# EAGLE board untitled (EAGLE 8.1.0)
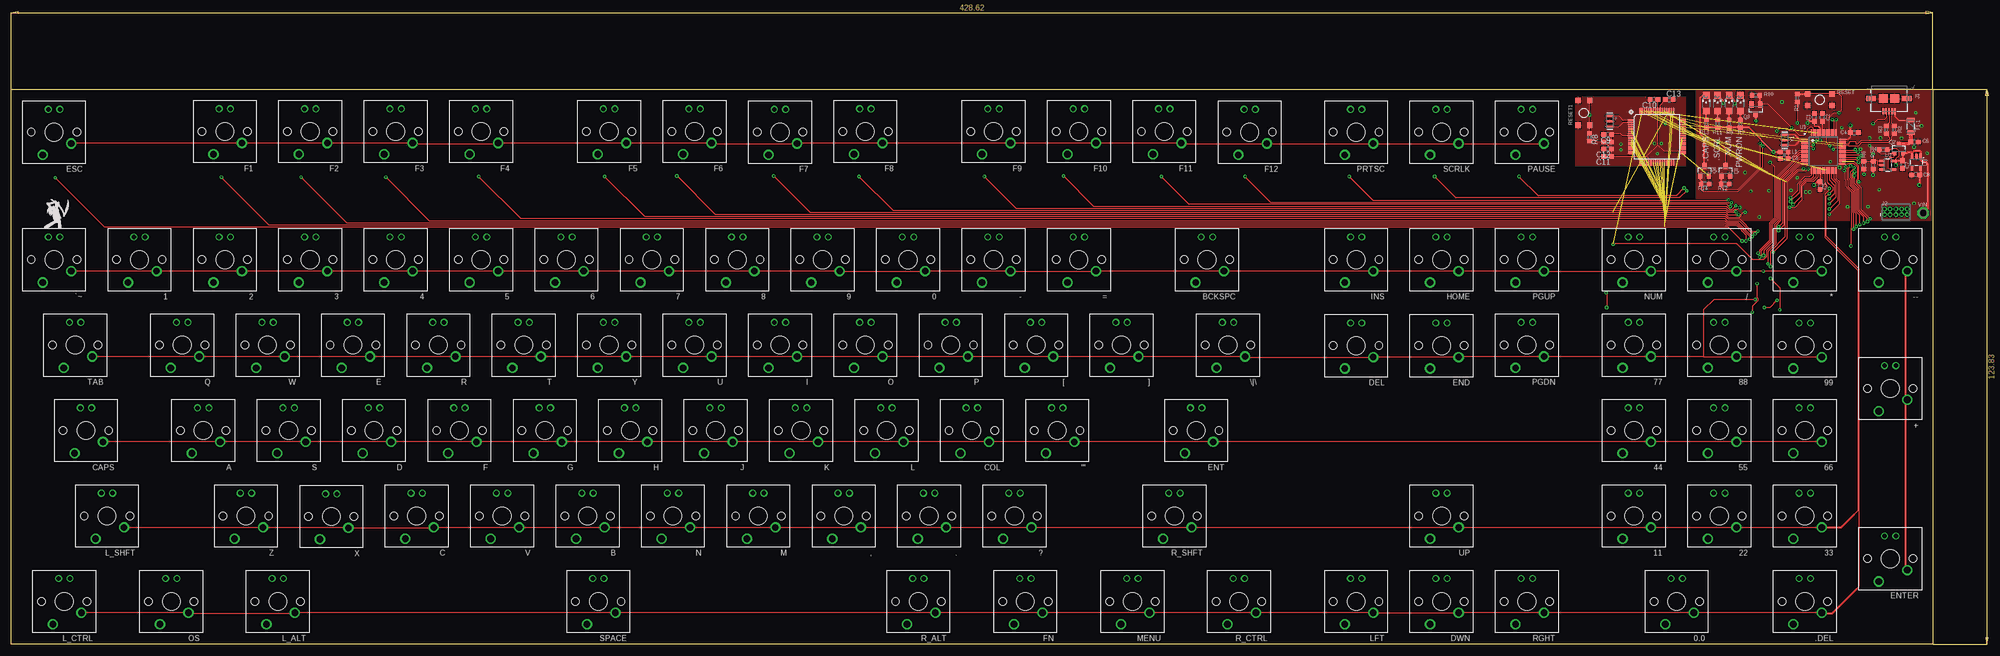
[diagram p6: board, top side]
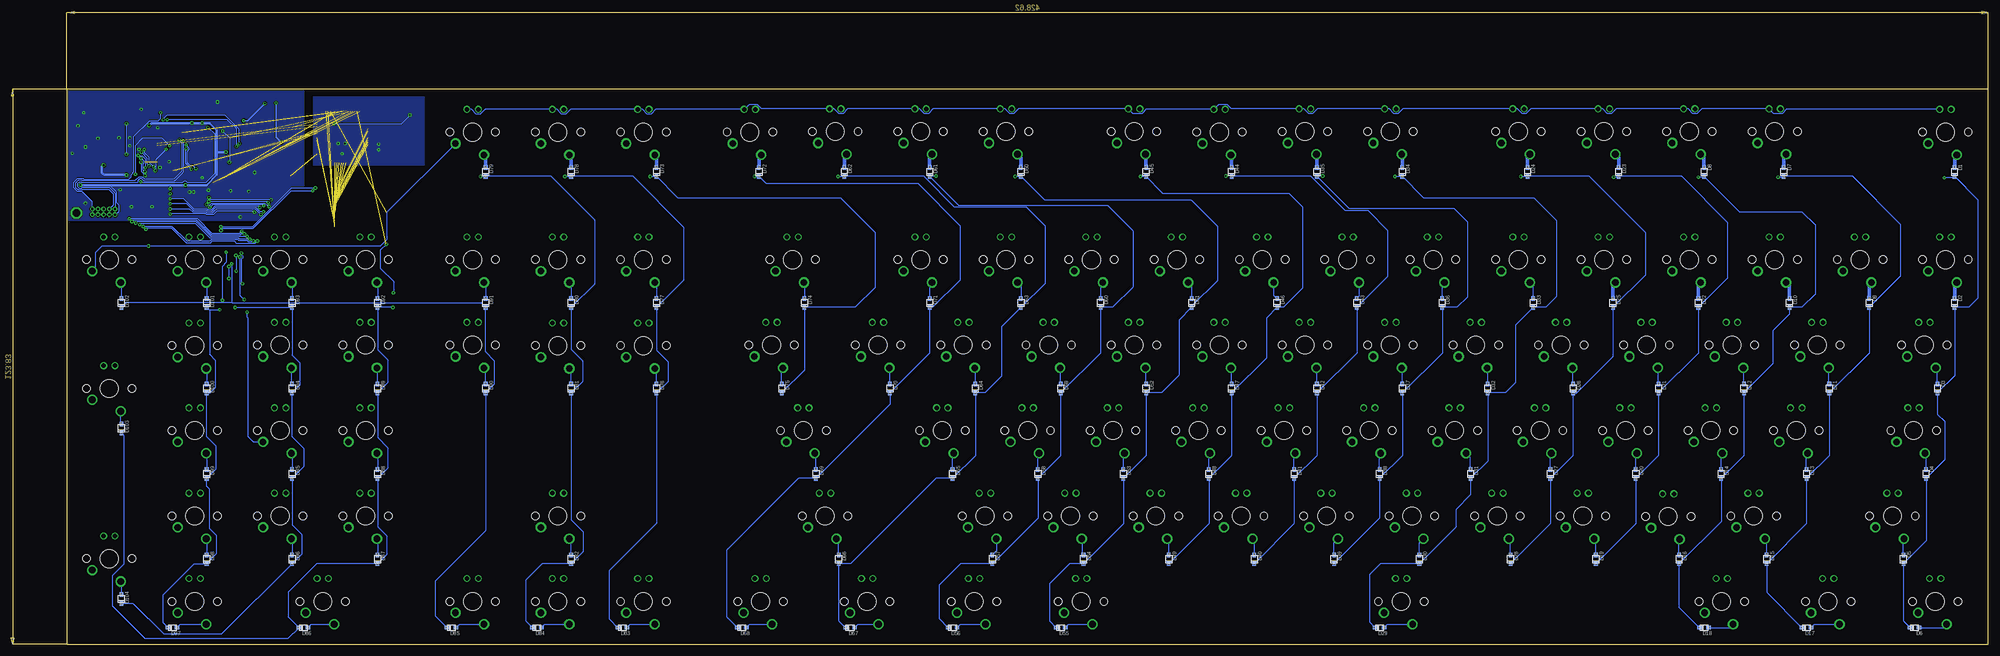
[diagram p7: board, bottom side, seen from below]

Size 428.62 x 123.83 mm. Coordinates in mm from the lower left corner, seen from the top.
Outline: 0,123.83 428.62,123.83 428.62,0 0,0 0,123.83
Copper layers (1*16): Top 0.035mm / dielectric 1.5mm / Bottom 0.035mm
Design rules "default *": minimum track width 8mil, minimum drill 0.3mm, track to track 6mil, track to pad 6mil, pad to pad 6mil, via to via 6mil, smd to smd 6mil, copper to edge 10mil, drill to drill 8mil, minimum pad ring 10mil, minimum via ring 8mil, stop-mask expansion 4mil, vias tented up to drill 15mil, thermal gap 10mil
Net classes: 1 USB: width 0.254 mm, drill 0.33 mm, clearance 0.159 mm; 2 Top GND Pour: clearance 0.762 mm to class 1

## Footprints (pad centres in the part's own frame; a part is rotated, then mirrored left to right if it is on the bottom)
CHERRY_MX = drill 1.5: 1 -3.81,2.54; 2 2.54,5.08 | drill 1: A -1.27,-5.08; K 1.27,-5.08 | hole 4: 0,0 | hole 1.7: 5.08,0; -5.08,0
CHIPLED_1206 = smd 1.5 x 1.5: A 0,-1.75; C 0,1.75
C0603 = smd 1.1 x 1: 1 -0.85,0; 2 0.85,0
SOD-323F = smd 1 x 0.8: A -1,0; C 1,0
PTC-1206 = smd 1 x 1.8: 1 -1.4,0; 2 1.4,0
USB_AB_MICRO_1:1_V2 = smd 1.4 x 0.4: D+ 2.85,0; D- 2.85,0.65; GND 2.85,-1.3; ID 2.85,-0.65; VBUS 2.85,1.3 | smd 1.27 x 2.2: SHIELD1 0,4; SHIELD4 0,-4 | smd 1.9 x 2: SHIELD2 0,1.25; SHIELD3 0,-1.25
2X5-PTH-1.27MM = drill 0.508 pad 1: 1 -2.54,-0.635; 2 -2.54,0.635; 3 -1.27,-0.635; 4 -1.27,0.635; 5 0,-0.635; 6 0,0.635; 7 1.27,-0.635; 8 1.27,0.635; 9 2.54,-0.635; 10 2.54,0.635
0603 = smd 1.1 x 1: 1 -0.85,0; 2 0.85,0
SOT23 = smd 1 x 1.4: 1 -0.95,-1.1; 2 0.95,-1.1; 3 0,1.1
SOT23-3 = smd 0.8 x 0.9: 1 -0.95,-1; 2 0.95,-1; 3 0,1.1
R0603 = smd 1 x 1.1: 1 -0.85,0; 2 0.85,0
7914G = smd 1.27 x 1.27: 1 0,0; 2 0,5.486; 3 2.54,0; 4 2.54,5.486
QFP50P900X900X120-48N = smd 1.45 x 0.3: 1 -4.2,2.75; 2 -4.2,2.25; 3 -4.2,1.75; 4 -4.2,1.25; 5 -4.2,0.75; 6 -4.2,0.25; 7 -4.2,-0.25; 8 -4.2,-0.75; 9 -4.2,-1.25; 10 -4.2,-1.75; 11 -4.2,-2.25; 12 -4.2,-2.75; 25 4.17,-2.75; 26 4.2,-2.25; 27 4.2,-1.75; 28 4.2,-1.25; 29 4.2,-0.75; 30 4.2,-0.25; 31 4.2,0.25; 32 4.2,0.75; 33 4.2,1.25; 34 4.2,1.75; 35 4.2,2.25; 36 4.2,2.75 | smd 0.3 x 1.45: 13 -2.75,-4.2; 14 -2.25,-4.2; 15 -1.75,-4.2; 16 -1.25,-4.2; 17 -0.75,-4.2; 18 -0.25,-4.2; 19 0.25,-4.2; 20 0.75,-4.2; 21 1.25,-4.2; 22 1.75,-4.2; 23 2.25,-4.2; 24 2.75,-4.2; 37 2.75,4.2; 38 2.25,4.2; 39 1.75,4.2; 40 1.25,4.2; 41 0.75,4.2; 42 0.25,4.2; 43 -0.25,4.2; 44 -0.75,4.2; 45 -1.25,4.2; 46 -1.75,4.2; 47 -2.25,4.2; 48 -2.75,4.2
SOT23-5 = smd 0.55 x 1.2: 1 -0.95,-1.3; 2 0,-1.3; 3 0.95,-1.3; 4 0.95,1.3; 5 -0.95,1.3
ATSAMD21J18 = smd 1.5 x 0.3: 1 -5.7,3.75; 2 -5.7,3.25; 3 -5.7,2.75; 4 -5.7,2.25; 5 -5.7,1.75; 6 -5.7,1.25; 7 -5.7,0.75; 8 -5.7,0.25; 9 -5.7,-0.25; 10 -5.7,-0.75; 11 -5.7,-1.25; 12 -5.7,-1.75; 13 -5.7,-2.25; 14 -5.7,-2.75; 15 -5.7,-3.25; 16 -5.7,-3.75; 33 5.75,-3.75; 34 5.75,-3.25; 35 5.75,-2.75; 36 5.75,-2.25; 37 5.75,-1.75; 38 5.75,-1.25; 39 5.75,-0.75; 40 5.75,-0.25; 41 5.75,0.25; 42 5.75,0.75; 43 5.75,1.25; 44 5.75,1.75; 45 5.75,2.25; 46 5.75,2.75; 47 5.75,3.25; 48 5.75,3.75 | smd 0.3 x 1.5: 17 -3.75,-5.75; 18 -3.25,-5.75; 19 -2.75,-5.75; 20 -2.25,-5.75; 21 -1.75,-5.75; 22 -1.25,-5.75; 23 -0.75,-5.75; 24 -0.25,-5.75; 25 0.25,-5.75; 26 0.75,-5.75; 27 1.25,-5.75; 28 1.75,-5.75; 29 2.25,-5.75; 30 2.75,-5.75; 31 3.25,-5.75; 32 3.75,-5.75; 49 3.75,5.75; 50 3.25,5.75; 51 2.75,5.75; 52 2.25,5.75; 53 1.75,5.75; 54 1.25,5.75; 55 0.75,5.75; 56 0.25,5.75; 57 -0.25,5.75; 58 -0.75,5.75; 59 -1.25,5.75; 60 -1.75,5.75; 61 -2.25,5.75; 62 -2.75,5.75; 63 -3.25,5.75; 64 -3.75,5.75
P1-17 = drill 1.702 pad 2.54 octagon: TP 0,0
RESONATOR-SMD = smd 0.45 x 1.905: 1 -1.2,0; 2 0,0; 3 1.2,0

## Placement (x,y rotation side)
0  CHERRY_MX  [CHERRY_MX]  200.06,85.77 180 top
0.0  CHERRY_MX  [CHERRY_MX]  371.51,9.57 180 top
1  CHERRY_MX  [CHERRY_MX]  28.61,85.77 180 top
2  CHERRY_MX  [CHERRY_MX]  47.66,85.77 180 top
3  CHERRY_MX  [CHERRY_MX]  66.71,85.77 180 top
4  CHERRY_MX  [CHERRY_MX]  85.76,85.77 180 top
5  CHERRY_MX  [CHERRY_MX]  104.81,85.77 180 top
6  CHERRY_MX  [CHERRY_MX]  123.86,85.77 180 top
7  CHERRY_MX  [CHERRY_MX]  142.91,85.77 180 top
8  CHERRY_MX  [CHERRY_MX]  161.96,85.77 180 top
9  CHERRY_MX  [CHERRY_MX]  181.01,85.77 180 top
11  CHERRY_MX  [CHERRY_MX]  361.98,28.62 180 top
22  CHERRY_MX  [CHERRY_MX]  381.03,28.62 180 top
33  CHERRY_MX  [CHERRY_MX]  400.08,28.62 180 top
44  CHERRY_MX  [CHERRY_MX]  361.98,47.67 180 top
55  CHERRY_MX  [CHERRY_MX]  381.03,47.67 180 top
66  CHERRY_MX  [CHERRY_MX]  400.08,47.67 180 top
77  CHERRY_MX  [CHERRY_MX]  361.98,66.72 180 top
88  CHERRY_MX  [CHERRY_MX]  381.03,66.72 180 top
99  CHERRY_MX  [CHERRY_MX]  400.08,66.59 180 top
'"  CHERRY_MX  [CHERRY_MX]  233.33,47.67 180 top
*  CHERRY_MX  [CHERRY_MX]  400.08,85.77 180 top
+  CHERRY_MX  [CHERRY_MX]  419.13,57.07 180 top
,  CHERRY_MX  [CHERRY_MX]  185.71,28.62 180 top
-  CHERRY_MX  [CHERRY_MX]  219.11,85.77 180 top
--  CHERRY_MX  [CHERRY_MX]  419.13,85.77 180 top
.  CHERRY_MX  [CHERRY_MX]  204.76,28.62 180 top
.CAPS  [CHIPLED_1206]  378.11,120.7 0 top
.DEL  CHERRY_MX  [CHERRY_MX]  400.08,9.57 180 top
.NUM  [CHIPLED_1206]  383.19,120.7 0 top
.SCRL  [CHIPLED_1206]  380.65,120.7 0 top
/  CHERRY_MX  [CHERRY_MX]  381.03,85.77 180 top
=  CHERRY_MX  [CHERRY_MX]  238.16,85.77 180 top
?  CHERRY_MX  [CHERRY_MX]  223.81,28.62 180 top
[  CHERRY_MX  [CHERRY_MX]  228.63,66.72 180 top
\|\  CHERRY_MX  [CHERRY_MX]  271.43,66.72 180 top
]  CHERRY_MX  [CHERRY_MX]  247.68,66.72 180 top
`~  CHERRY_MX  [CHERRY_MX]  9.56,85.77 180 top
A  CHERRY_MX  [CHERRY_MX]  42.83,47.67 180 top
B  CHERRY_MX  [CHERRY_MX]  128.56,28.62 180 top
BCKSPC  CHERRY_MX  [CHERRY_MX]  266.73,85.77 180 top
C  CHERRY_MX  [CHERRY_MX]  90.46,28.62 180 top
C1  0.1uF  [C0603]  402.24,117.52 90 top
C2  0.1uF  [C0603]  404.02,117.52 90 top
C3  0.1uF  [C0603]  395.51,108.38 180 top
C4  0.1uF  [C0603]  411.13,114.09 0 top
C5  0.1uF  [C0603]  403.51,102.28 270 top
C6  2.2uF  [C0603]  424.59,112.06 0 top
C7  1.0uF  [C0603]  421.93,106.98 270 top
C8  2.2uF  [C0603]  424.85,104.7 180 top
C9  0.1uF  [C0603]  356.14,113.66 180 top
C10  0.1uF  [C0603]  366.43,121.46 180 top
C11  0.1uF  [C0603]  356.14,108.81 180 top
C12  0.1uF  [C0603]  356.14,110.44 180 top
C13  0.1uF  [C0603]  369.86,121.46 0 top
CAPS  CHERRY_MX  [CHERRY_MX]  16.67,47.67 180 top
COL  CHERRY_MX  [CHERRY_MX]  214.28,47.67 180 top
D  CHERRY_MX  [CHERRY_MX]  80.93,47.67 180 top
D1  [SOD-323F]  7.52,105.33 270 bottom
D2  [SOD-323F]  7.52,76.12 270 bottom
D3  [SOD-323F]  11.33,57.07 270 bottom
D4  [SOD-323F]  13.88,38.02 270 bottom
D5  [SOD-323F]  18.95,18.97 270 bottom
D6  [SOD-323F]  16.42,3.73 180 bottom
D7  [SOD-323F]  45.62,105.33 270 bottom
D8  [SOD-323F]  63.4,105.33 270 bottom
D9  [SOD-323F]  26.57,76.12 270 bottom
D10  [SOD-323F]  44.36,76.12 270 bottom
D11  [SOD-323F]  35.46,57.07 270 bottom
D12  [SOD-323F]  54.51,57.07 270 bottom
D13  [SOD-323F]  40.55,38.02 270 bottom
D14  [SOD-323F]  59.59,38.02 270 bottom
D15  [SOD-323F]  49.44,18.97 270 bottom
D16  [SOD-323F]  68.99,18.97 270 bottom
D17  [SOD-323F]  40.55,3.73 180 bottom
D18  [SOD-323F]  63.4,3.73 180 bottom
D19  [SOD-323F]  87.53,18.97 270 bottom
D20  [SOD-323F]  78.64,38.02 270 bottom
D21  [SOD-323F]  73.56,57.07 270 bottom
D22  [SOD-323F]  64.68,76.12 270 bottom
D23  [SOD-323F]  82.45,105.33 270 bottom
D24  [SOD-323F]  102.77,105.33 270 bottom
D25  [SOD-323F]  83.73,76.12 270 bottom
D26  [SOD-323F]  92.62,57.07 270 bottom
D27  [SOD-323F]  97.69,38.02 270 bottom
D28  [SOD-323F]  106.58,18.97 270 bottom
D29  [SOD-323F]  135.8,3.73 180 bottom
D30  [SOD-323F]  126.9,18.97 270 bottom
D31  [SOD-323F]  115.48,38.02 270 bottom
D32  [SOD-323F]  111.67,57.07 270 bottom
D33  [SOD-323F]  101.5,76.12 270 bottom
D34  [SOD-323F]  130.71,105.33 270 bottom
D35  [SOD-323F]  149.76,105.33 270 bottom
D36  [SOD-323F]  121.82,76.12 270 bottom
D37  [SOD-323F]  130.71,57.07 270 bottom
D38  [SOD-323F]  135.8,38.02 270 bottom
D39  [SOD-323F]  145.95,18.97 270 bottom
D40  [SOD-323F]  163.74,18.97 270 bottom
D41  [SOD-323F]  154.84,38.02 270 bottom
D42  [SOD-323F]  149.76,57.07 270 bottom
D43  [SOD-323F]  140.88,76.12 270 bottom
D44  [SOD-323F]  168.81,105.33 270 bottom
D45  [SOD-323F]  187.87,105.33 270 bottom
D46  [SOD-323F]  158.65,76.12 270 bottom
D47  [SOD-323F]  168.81,57.07 270 bottom
D48  [SOD-323F]  173.89,38.02 270 bottom
D49  [SOD-323F]  182.78,18.97 270 bottom
D50  [SOD-323F]  215.81,105.33 270 bottom
D51  [SOD-323F]  177.7,76.12 270 bottom
D52  [SOD-323F]  187.87,57.07 270 bottom
D53  [SOD-323F]  192.94,38.02 270 bottom
D54  [SOD-323F]  201.83,18.97 270 bottom
D55  [SOD-323F]  206.92,3.73 180 bottom
D56  [SOD-323F]  231.04,3.73 180 bottom
D57  [SOD-323F]  222.15,18.97 270 bottom
D58  [SOD-323F]  212,38.02 270 bottom
D59  [SOD-323F]  206.92,57.07 270 bottom
D60  [SOD-323F]  198.02,76.12 270 bottom
D61  [SOD-323F]  236.12,105.33 270 bottom
D62  [SOD-323F]  255.17,105.33 270 bottom
D63  [SOD-323F]  215.81,76.12 270 bottom
D64  [SOD-323F]  225.97,57.07 270 bottom
D65  [SOD-323F]  231.04,38.02 270 bottom
D66  [SOD-323F]  256.45,18.97 270 bottom
D67  [SOD-323F]  253.9,3.73 180 bottom
D68  [SOD-323F]  278.03,3.73 180 bottom
D69  [SOD-323F]  261.52,38.02 270 bottom
D70  [SOD-323F]  245.01,57.07 270 bottom
D71  [SOD-323F]  236.12,76.12 270 bottom
D72  [SOD-323F]  274.23,105.33 270 bottom
D73  [SOD-323F]  297.09,105.33 270 bottom
D74  [SOD-323F]  264.06,76.12 270 bottom
D75  [SOD-323F]  269.14,57.07 270 bottom
D76  [SOD-323F]  297.09,57.07 270 bottom
D77  [SOD-323F]  297.09,76.12 270 bottom
D78  [SOD-323F]  316.13,105.33 270 bottom
D79  [SOD-323F]  335.18,105.33 270 bottom
D80  [SOD-323F]  316.13,76.12 270 bottom
D81  [SOD-323F]  316.13,57.07 270 bottom
D82  [SOD-323F]  316.13,18.97 270 bottom
D83  [SOD-323F]  304.71,3.73 180 bottom
D84  [SOD-323F]  323.75,3.73 180 bottom
D85  [SOD-323F]  342.8,3.73 180 bottom
D86  [SOD-323F]  375.83,3.73 180 bottom
D87  [SOD-323F]  359.31,18.97 270 bottom
D88  [SOD-323F]  359.31,38.02 270 bottom
D89  [SOD-323F]  359.31,57.07 270 bottom
D90  [SOD-323F]  335.18,57.07 270 bottom
D91  [SOD-323F]  335.18,76.12 270 bottom
D92  [SOD-323F]  359.31,76.12 270 bottom
D93  [SOD-323F]  378.37,76.12 270 bottom
D94  [SOD-323F]  378.37,57.07 270 bottom
D95  [SOD-323F]  378.37,38.02 270 bottom
D96  [SOD-323F]  378.37,18.97 270 bottom
D97  [SOD-323F]  405.03,3.73 180 bottom
D98  [SOD-323F]  397.41,18.97 270 bottom
D99  [SOD-323F]  397.41,38.02 270 bottom
D100  [SOD-323F]  397.41,57.07 270 bottom
D101  [SOD-323F]  397.41,76.12 270 bottom
D102  [SOD-323F]  416.47,76.12 270 bottom
D103  [SOD-323F]  416.47,48.18 270 bottom
D104  [SOD-323F]  416.47,10.08 270 bottom
DEL  CHERRY_MX  [CHERRY_MX]  300.01,66.59 180 top
DWN  CHERRY_MX  [CHERRY_MX]  319.06,9.57 180 top
E  CHERRY_MX  [CHERRY_MX]  76.23,66.72 180 top
END  CHERRY_MX  [CHERRY_MX]  319.06,66.59 180 top
ENT  CHERRY_MX  [CHERRY_MX]  264.32,47.67 180 top
ENTER  CHERRY_MX  [CHERRY_MX]  419.13,19.1 180 top
ESC  CHERRY_MX  [CHERRY_MX]  9.56,114.22 180 top
F  CHERRY_MX  [CHERRY_MX]  99.98,47.67 180 top
F1  CHERRY_MX  [CHERRY_MX]  47.66,114.35 180 top
F1-1  PTCSMD  [PTC-1206]  423.7,115.49 270 top
F2  CHERRY_MX  [CHERRY_MX]  66.71,114.35 180 top
F3  CHERRY_MX  [CHERRY_MX]  85.76,114.35 180 top
F4  CHERRY_MX  [CHERRY_MX]  104.81,114.35 180 top
F5  CHERRY_MX  [CHERRY_MX]  133.38,114.35 180 top
F6  CHERRY_MX  [CHERRY_MX]  152.43,114.35 180 top
F7  CHERRY_MX  [CHERRY_MX]  171.48,114.22 180 top
F8  CHERRY_MX  [CHERRY_MX]  190.53,114.35 180 top
F9  CHERRY_MX  [CHERRY_MX]  219.11,114.35 180 top
F10  CHERRY_MX  [CHERRY_MX]  238.16,114.35 180 top
F11  CHERRY_MX  [CHERRY_MX]  257.21,114.35 180 top
F12  CHERRY_MX  [CHERRY_MX]  276.26,114.22 180 top
FN  CHERRY_MX  [CHERRY_MX]  226.22,9.57 180 top
G  CHERRY_MX  [CHERRY_MX]  119.03,47.67 180 top
H  CHERRY_MX  [CHERRY_MX]  138.08,47.67 180 top
HOME  CHERRY_MX  [CHERRY_MX]  319.06,85.77 180 top
I  CHERRY_MX  [CHERRY_MX]  171.48,66.72 180 top
INS  CHERRY_MX  [CHERRY_MX]  300.01,85.77 180 top
J  CHERRY_MX  [CHERRY_MX]  157.13,47.67 180 top
J1  [USB_AB_MICRO_1:1_V2]  418.88,121.71 270 top
J2  CORTEX_DEBUGPTH  [2X5-PTH-1.27MM]  420.4,96.44 0 top
K  CHERRY_MX  [CHERRY_MX]  176.18,47.67 180 top
L  CHERRY_MX  [CHERRY_MX]  195.23,47.67 180 top
L1  FB-30OHM  [0603]  395.51,109.78 180 top
L2  FB-30OHM  [0603]  356.14,112.04 180 top
L_ALT  CHERRY_MX  [CHERRY_MX]  59.47,9.57 180 top
L_CTRL  CHERRY_MX  [CHERRY_MX]  11.84,9.57 180 top
L_SHFT  CHERRY_MX  [CHERRY_MX]  21.37,28.62 180 top
LFT  CHERRY_MX  [CHERRY_MX]  300.01,9.57 180 top
M  CHERRY_MX  [CHERRY_MX]  166.66,28.62 180 top
MENU  CHERRY_MX  [CHERRY_MX]  250.1,9.57 180 top
N  CHERRY_MX  [CHERRY_MX]  147.61,28.62 180 top
NUM  CHERRY_MX  [CHERRY_MX]  361.98,85.77 180 top
O  CHERRY_MX  [CHERRY_MX]  190.53,66.72 180 top
OS  CHERRY_MX  [CHERRY_MX]  35.72,9.57 180 top
P  CHERRY_MX  [CHERRY_MX]  209.58,66.72 180 top
PAUSE  CHERRY_MX  [CHERRY_MX]  338.11,114.22 180 top
PGDN  CHERRY_MX  [CHERRY_MX]  338.11,66.72 180 top
PGUP  CHERRY_MX  [CHERRY_MX]  338.11,85.77 180 top
PRTSC  CHERRY_MX  [CHERRY_MX]  300.01,114.22 180 top
PWRON  [CHIPLED_1206]  385.73,120.7 0 top
Q  CHERRY_MX  [CHERRY_MX]  38.13,66.72 180 top
Q1  2N7002  [SOT23]  382.43,105.58 0 top
Q2  2.5A/30V  [SOT23-3]  421.04,110.54 0 top
Q3  2N7002  [SOT23]  389.16,119.3 180 top
Q4  2N7002  [SOT23]  377.73,105.58 0 top
R  CHERRY_MX  [CHERRY_MX]  95.28,66.72 180 top
R1  [R0603]  398.43,121.84 270 top
R2  33R  [R0603]  420.02,114.73 270 top
R3  33R  [R0603]  418.24,114.73 270 top
R4  47K  [R0603]  417.61,110.28 0 top
R5  100K  [R0603]  415.32,106.85 270 top
R6  330  [R0603]  413.29,106.85 90 top
R7  47K  [R0603]  385.73,116.13 270 top
R8  [R0603]  352.08,113.1 270 top
R9  47K  [R0603]  383.19,116.13 270 top
R10  47K  [R0603]  389.16,122.47 0 top
R11  47K  [R0603]  380.65,116.13 270 top
R12  47K  [R0603]  382.3,102.66 180 top
R13  47K  [R0603]  378.11,116.13 270 top
R14  47K  [R0603]  377.86,102.66 180 top
R_ALT  CHERRY_MX  [CHERRY_MX]  202.34,9.57 180 top
R_CTRL  CHERRY_MX  [CHERRY_MX]  273.84,9.57 180 top
R_SHFT  CHERRY_MX  [CHERRY_MX]  259.49,28.62 180 top
RESET  TACTILE-SWITCH-7914G  [7914G]  406.18,120.19 90 top
RESET1  TACTILE-SWITCH-7914G  [7914G]  349.54,115.77 0 top
RGHT  CHERRY_MX  [CHERRY_MX]  338.11,9.57 180 top
S  CHERRY_MX  [CHERRY_MX]  61.88,47.67 180 top
SCRLK  CHERRY_MX  [CHERRY_MX]  319.06,114.22 180 top
SPACE  CHERRY_MX  [CHERRY_MX]  130.97,9.57 180 top
T  CHERRY_MX  [CHERRY_MX]  114.33,66.72 180 top
TAB  CHERRY_MX  [CHERRY_MX]  14.26,66.72 180 top
U  CHERRY_MX  [CHERRY_MX]  152.43,66.72 180 top
U1  ATSAMD21G18A-AU  [QFP50P900X900X120-48N]  404.27,109.9 0 top
U2  74AHC1G125  [SOT23-5]  418.62,106.85 270 top
U3  3.3V  [SOT23-5]  424.97,107.49 180 top
U4  ATSAMD21J18  [ATSAMD21J18]  367.06,113.18 0 top
UP  CHERRY_MX  [CHERRY_MX]  319.06,28.62 180 top
V  CHERRY_MX  [CHERRY_MX]  109.51,28.62 180 top
VIN  PTR1PAD1-17  [P1-17]  426.5,96.19 0 top
W  CHERRY_MX  [CHERRY_MX]  57.18,66.72 180 top
X  CHERRY_MX  [CHERRY_MX]  71.41,28.5 180 top
Y  CHERRY_MX  [CHERRY_MX]  133.38,66.72 180 top
Y1  32.768KHz  [RESONATOR-SMD]  395.64,112.44 270 top
Y2  32.768KHz  [RESONATOR-SMD]  356.57,116.66 270 top
Z  CHERRY_MX  [CHERRY_MX]  52.36,28.62 180 top

## Tracks (layer width: path | path; a pad name or v marks a point on that pad's centre or on a via)
CAPS  (via drill 0.3)
  Top 0.203: R14.2 377.01,101.35 377.35,101.01 385.24,101.01 390.75,106.52 v390.75,111.04 | v406.23,117.01 406.48,116.76 406.52,116.72 U1.38
  Top 0.406: R14.2 377.01,103.39 376.78,103.61 Q4.1
  Bottom 0.203: v390.75,111.04 390.75,114.93 392.84,117.01 v406.23,117.01
COL_0  (via drill 0.3)  (1 unrouted)
  Top 0.203: v392.46,84.25 392.46,87.68 395.74,90.96 395.74,103.16 398.42,105.84 399.57,105.84 v399.83,106.09 | v392.46,81.58 394.49,79.55 v394.49,74.6 | U1.3 401.73,111.65 v401.99,111.4
  Bottom 0.203: D97.C 407.07,4.76 407.07,11.1 400.19,17.97 D98.C 395.13,20.26 395.13,24.18 396.78,25.83 396.78,34.59 397.41,35.23 D99.C 395.26,39.18 395.26,44.12 397.41,46.28 D100.C 396.64,56.07 395.38,57.32 395.38,63.29 396.78,64.69 396.78,74.49 | 396.78,74.49 D101.C | v394.49,74.6 394.61,74.49 396.78,74.49 | v392.46,84.25 v392.46,81.58 | v401.99,111.4 | v401.99,111.4 401.38,110.79 401.38,110.28 401.88,109.78 401.88,107.51 401.16,106.79 400.52,106.79 v399.83,106.09
COL_1  (via drill 0.3)  (1 unrouted)
  Top 0.203: U1.4 401.37,111.15 v401.99,110.54 | v400.84,105.97 400.34,105.46 398.56,105.46 396.1,103 396.1,90.46 v393.07,87.43 | v393.89,76.73 392.26,75.1 v391.06,75.1
  Bottom 0.203: D104.C 413.81,9.08 406.94,2.21 394.13,2.21 D96.C 376.21,20.13 376.21,24.56 378.37,26.72 D95.C 375.83,39.56 375.83,43.74 378.37,46.28 D94.C 376.59,57.85 376.59,62.66 378.37,64.44 D93.C 391.05,75.12 v391.06,75.1 | v401.99,110.54 402.24,110.28 402.24,107.36 v400.84,105.97 | v393.07,87.43 393.07,85.17 393.99,84.25 393.99,76.83 v393.89,76.73
COL_2  (via drill 0.3)  (1 unrouted)
  Top 0.203: v355.76,78.41 355.89,78.28 v355.89,75.1 | U1.9 398.83,108.65 398.25,108.07 398.25,107.69 394.32,103.76 394.32,94.58 393.28,93.54 393.28,89.5 391.5,87.72 391.5,86.46 390.81,85.77 388.52,85.77 384.97,89.33 357.41,89.33 v357.33,89.24
  Bottom 0.203: D103.C 415.96,46.67 415.96,17.83 418.5,15.29 418.5,8.56 411.26,1.32 379.24,1.32 D86.C 379.25,6.16 379.25,11.6 372.89,17.97 D87.C 357.28,20 357.28,24.18 359.31,26.21 D88.C 357.03,39.31 357.03,43.86 359.31,46.15 D89.C 357.03,58.36 357.03,63.42 359.31,65.71 D92.C 355.9,75.12 v355.89,75.1 | v357.33,89.24 358.68,87.89 358.68,83.87 355.76,80.95 v355.76,78.41
COL_3  (via drill 0.3)  (1 unrouted)
  Top 0.203: U1.10 398.84,108.15 398.61,107.92 398.61,107.54 394.68,103.61 394.68,97.51 | 394.68,97.51 394.67,97.51 | v391.86,84.86 391.86,87.57 393.63,89.35 393.63,93.39 394.68,94.43 394.68,97.51
  Bottom 0.203: D85.C 346.49,6.41 346.49,14.02 335.18,25.32 D90.C 333.28,57.98 333.28,63.29 335.18,65.2 D91.C 336.18,76.12 391.7,76.12 | D102.C 415.47,76.12 391.7,76.12 | v391.86,84.86 391.86,76.28 391.7,76.12
COL_4  (via drill 0.3)  (1 unrouted)
  Top 0.203: U1.11 399.1,107.65 398.96,107.51 398.96,107.39 395.03,103.46 395.03,93.93 v394.24,93.14 | v373.16,101.77 371.38,100 368.84,100
  Top 0.254: v336.33,104.31 340.65,100 368.84,100
  Bottom 0.203: D79.C 320.6,104.33 310.93,94.66 310.93,80.33 D80.C 316.13,65.83 313.6,63.29 313.6,58.61 D81.C 316.13,27.73 313.47,25.07 313.47,20.64 D82.C 322.6,17.97 326.29,14.27 326.29,5.27 D84.C | v394.24,93.14 387.13,93.14 378.49,101.77 v373.16,101.77
  Bottom 0.254: D79.C 335.2,104.31 v336.33,104.31
COL_5  (via drill 0.3)  (1 unrouted)
  Top 0.203: U1.12 399.23,107.15 395.39,103.31 395.39,93.43 v394.24,92.28 | v373.76,101.17 372.14,99.54 368.84,99.54
  Top 0.254: v317.53,104.31 322.31,99.54 368.84,99.54
  Bottom 0.203: D78.C 302.31,104.33 290.99,93.01 290.99,81.22 D77.C 297.09,65.58 294.54,63.04 294.54,58.61 D76.C 297.09,26.97 307.63,16.43 307.63,5.65 D83.C | v394.24,92.28 393.76,92.76 387,92.76 378.59,101.17 v373.76,101.17
  Bottom 0.254: D78.C 316.15,104.31 v317.53,104.31
COL_6  (via drill 0.3)  (1 unrouted)
  Top 0.203: U1.13 401.52,104.61 401.15,104.24 400.02,104.24 398.51,102.72 398.51,101.22 v396.91,99.62 | 368.84,99.08 383.04,99.08 v383.06,99.11
  Top 0.254: v298.48,104.31 303.71,99.08 368.84,99.08
  Bottom 0.203: D73.C 292.37,99.62 256.06,99.62 248.32,91.87 248.32,79.55 252.75,75.12 D74.C 264.06,61.15 D75.C | v383.06,99.11 396.4,99.11 v396.91,99.62
  Bottom 0.254: D73.C 297.1,104.31 v298.48,104.31
COL_7  (via drill 0.3)  (1 unrouted)
  Top 0.203: U1.14 402.02,104.32 401.59,103.88 400.17,103.88 398.86,102.58 398.86,100.71 v396.91,98.76 | 368.84,98.62 382.69,98.62 382.81,98.5 v383.7,98.5
  Top 0.254: v275.24,104.31 280.93,98.62 368.84,98.62
  Bottom 0.203: D72.C 272.68,102.79 238.79,102.79 229.39,93.39 229.39,81.2 235.47,75.12 D71.C 236.12,64.96 D70.C 245.01,53.53 D69.C 265.45,37.02 281.46,21 281.46,6.16 D68.C | v383.7,98.5 383.95,98.75 396.55,98.75 396.55,98.76 v396.91,98.76
  Bottom 0.254: D72.C 274.24,104.31 v275.24,104.31
COL_8  (via drill 0.3)  (1 unrouted)
  Top 0.203: U1.15 402.52,104.32 401.73,103.53 400.32,103.53 399.22,102.43 399.22,99.85 v397.44,98.07 | v383.48,97.64 383.17,97.64 382.64,98.17 382.44,98.17 | 382.44,98.17 | 382.44,98.17 368.84,98.17
  Top 0.254: v256.57,104.31 262.72,98.17 368.84,98.17
  Bottom 0.203: D62.C 237.46,104.33 230.68,97.56 214.64,97.56 210.47,93.39 210.47,80.45 D63.C 220.12,70.8 220.12,59.74 223.79,56.07 D64.C 225.97,42.1 D65.C 234.71,37.02 253.76,17.97 D66.C 256.45,5.27 D67.C | v397.44,98.07 396.67,98.07 396.35,98.4 384.45,98.4 383.95,97.89 383.74,97.89 v383.48,97.64
  Bottom 0.254: D62.C 255.19,104.31 v256.57,104.31
COL_9  (via drill 0.3)  (1 unrouted)
  Top 0.203: U1.16 403.02,104.21 401.99,103.17 400.46,103.17 399.57,102.28 399.57,100 | 368.84,97.71 382.56,97.71 383.23,97.03 383.95,97.03 v384.71,97.79 | v396.71,97.46 397.93,97.46 399.57,99.11 399.57,100 | 399.57,100
  Top 0.254: v234.73,104.44 241.46,97.71 368.84,97.71
  Bottom 0.203: D61.C 229.76,97.96 196.5,97.96 190.79,92.25 190.79,79.68 195.34,75.12 D60.C 198.02,64.96 D59.C 206.92,42.1 D58.C 212,28.13 D57.C 229.25,17.97 234.09,13.13 234.09,5.78 D56.C | v384.71,97.79 384.96,98.04 396.13,98.04 v396.71,97.46
  Bottom 0.254: D61.C 236.01,104.44 v234.73,104.44
COL_10  (via drill 0.3)  (1 unrouted)
  Top 0.203: U1.21 405.52,103.57 406.69,102.41 406.69,100.5 v405.54,99.36 | 368.84,97.25 382.51,97.25 383.09,96.68 384.1,96.68 384.48,97.06 385.19,97.06 v385.56,97.43
  Top 0.254: v217.07,104.31 224.14,97.25 368.84,97.25
  Bottom 0.203: D50.C 210.58,99.11 177.83,99.11 171.99,93.27 171.99,81.07 177.7,75.36 D51.C | D51.C 177.7,75.1 | D51.C 180.5,72.33 180.5,59.99 184.42,56.07 D52.C 187.87,42.1 D53.C 192.94,26.86 D54.C 204.99,17.97 209.45,13.51 209.45,5.27 D55.C | v385.56,97.43 385.82,97.69 395.63,97.69 396.46,96.86 396.96,96.86 397.18,97.08 400.21,97.08 402.5,99.36 v405.54,99.36
  Bottom 0.254: D50.C 215.82,104.31 v217.07,104.31
COL_11  (via drill 0.3)  (1 unrouted)
  Top 0.203: U1.22 406.02,103.96 407.04,102.94 407.04,99.72 v405.54,98.22 | v384.73,96.45 384.37,96.45 384.25,96.32 382.94,96.32 382.47,96.8 368.84,96.8
  Top 0.254: v189.13,104.31 196.65,96.8 368.84,96.8
  Bottom 0.203: D45.C 184.17,100.63 155.99,100.63 152.94,97.58 152.94,79.42 157.24,75.12 D46.C 161.07,72.71 161.07,63.82 D47.C 168.81,42.1 D48.C 173.89,26.86 D49.C | v384.73,96.45 385.49,96.45 386.37,97.33 395.48,97.33 396.31,96.5 397.11,96.5 397.3,96.69 400.33,96.69 401.86,98.22 v405.54,98.22
  Bottom 0.254: D45.C 187.88,104.31 v189.13,104.31
COL_12  (via drill 0.3)  (1 unrouted)
  Top 0.203: v405.54,97.08 407.4,98.93 407.4,103.09 406.52,103.96 U1.23 | 368.71,96.34 382.42,96.34 382.91,95.84 385.28,95.84 v385.31,95.82
  Top 0.254: v170.08,104.44 178.19,96.34 368.71,96.34
  Bottom 0.203: D44.C 151.1,104.33 143.56,96.8 138.44,96.8 134.02,92.38 134.02,81.98 D43.C 140.88,64.96 D42.C 149.76,42.1 D41.C 154.84,26.86 D40.C | v385.31,95.82 385.59,96.09 385.63,96.09 386.51,96.97 395.33,96.97 396.16,96.15 397.25,96.15 397.45,96.34 400.48,96.34 401.16,97.02 405.49,97.02 v405.54,97.08
  Bottom 0.254: D44.C 168.93,104.44 v170.08,104.44
COL_13  (via drill 0.3)  (1 unrouted)
  Top 0.203: v405.54,95.93 407.75,98.14 407.75,103.24 407.02,103.97 U1.24 | 368.84,95.88 376.31,95.88 376.34,95.9 382.35,95.9 383.05,95.21 385.56,95.21 385.92,95.56 385.92,95.93 386.35,96.37 v386.76,96.37
  Top 0.254: v148.5,104.44 157.06,95.88 368.84,95.88
  Bottom 0.203: D35.C 142.64,97.2 119.16,97.2 116.24,94.28 116.24,77.39 118.51,75.12 D36.C 121.82,64.96 D37.C 130.71,42.1 D38.C 135.8,28.13 D39.C | v386.76,96.37 387.02,96.62 395.18,96.62 396.01,95.79 397.4,95.79 397.59,95.98 405.49,95.98 v405.54,95.93
  Bottom 0.254: D35.C 149.65,104.44 v148.5,104.44
COL_14  (via drill 0.3)  (1 unrouted)
  Top 0.203: U1.25 409.78,107.15 409.92,107.3 410.95,107.3 411.79,106.45 411.79,103.67 411.54,103.42 411.54,102.92 412.65,101.8 412.65,96.95 v414.69,94.92 | 368.84,95.42 382.33,95.42 382.9,94.85 385.6,94.85 388.31,92.15 v389.6,92.15
  Top 0.254: v132.37,104.31 141.26,95.42 368.84,95.42
  Bottom 0.203: D34.C 126,99.62 101.38,99.62 96.3,94.53 96.3,77.52 98.69,75.12 D33.C 105.44,71.18 105.44,58.34 107.71,56.07 D32.C 111.67,40.83 D31.C 115.48,33.32 118.78,30.02 118.78,26.1 D30.C 135.65,17.97 138.08,15.54 138.08,5.02 D29.C | v389.6,92.15 390.13,91.61 396.14,91.61 399.45,94.92 v414.69,94.92
  Bottom 0.254: D34.C 130.73,104.31 v132.37,104.31
COL_15  (via drill 0.3)  (1 unrouted)
  Top 0.203: U1.27 411.45,108.15 v412.07,107.54 | v411.15,104.54 411.15,102.8 412.29,101.66 412.29,97.58 412.3,97.58 412.3,96.8 414.08,95.02 v414.08,94.31 | 368.84,94.97 382.28,94.97 382.75,94.5 385.46,94.5 388.16,91.79 388.74,91.79 v388.99,91.54
  Top 0.254: v104.3,104.31 113.65,94.97 368.84,94.97
  Bottom 0.203: D24.C 88.95,104.33 76.49,91.87 76.49,82.36 D25.C 83.73,64.18 91.98,55.93 92.47,55.93 D26.C 92.62,42.1 D27.C 97.69,26.86 D28.C | v412.07,107.54 412.07,105.46 v411.15,104.54 | v388.99,91.54 389.7,91.54 389.99,91.26 396.29,91.26 399.59,94.56 413.83,94.56 v414.08,94.31
  Bottom 0.254: D24.C 102.79,104.31 v104.3,104.31
COL_16  (via drill 0.3)  (1 unrouted)
  Top 0.203: U1.28 411.81,108.65 v412.07,108.4 | v411.17,105.42 410.55,104.79 410.55,104.29 410.8,104.04 410.8,102.65 411.94,101.52 411.94,97.2 411.94,97.19 411.94,96.65 413.22,95.38 v413.22,93.95 | 368.84,94.51 382.24,94.51 382.6,94.14 385.18,94.14 v388.38,90.94
  Top 0.254: v83.6,104.19 93.27,94.51 368.84,94.51
  Bottom 0.203: D23.C 68.37,104.33 58.2,94.15 58.2,81.6 D22.C 64.68,64.96 D21.C 73.56,42.1 D20.C 78.64,26.86 D19.C | v412.07,108.4 | v412.07,108.4 411.46,107.79 411.46,107.29 411.71,107.03 411.71,105.84 411.29,105.42 v411.17,105.42 | 390.13,90.9 | v388.38,90.94 | v388.38,90.94 388.42,90.9 390.13,90.9 | v413.22,93.95 412.97,94.21 399.74,94.21 396.44,90.9 390.13,90.9
  Bottom 0.254: D23.C 82.6,104.19 v83.6,104.19
COL_17  (via drill 0.3)  (1 unrouted)
  Top 0.203: U1.29 412.53,109.15 v412.68,109 | v411.11,106.28 411.11,106.21 410.19,105.3 410.19,104.15 410.44,103.89 410.44,102.51 411.58,101.37 411.58,97.06 411.59,97.05 411.59,96.51 412.36,95.73 v412.36,93.6 | 368.84,94.05 382.19,94.05 382.46,93.79 385.03,93.79 387.78,91.04 v387.78,90.33
  Top 0.254: v64.68,104.19 74.81,94.05 368.84,94.05
  Bottom 0.203: D18.C 68.99,8.32 D16.C 59.59,27.37 D14.C 54.51,42.1 D12.C 48.04,62.55 48.04,69.9 44.36,73.58 D10.C 41.55,75.12 38.64,78.03 38.64,93.52 41.56,96.44 55.51,96.44 D8.C | v412.68,109 412.33,109 412.32,109 411.82,109 411.11,108.29 411.11,107.14 411.13,107.11 411.13,106.3 v411.11,106.28 | v387.78,90.33 | v387.78,90.33 390.06,90.33 390.28,90.55 396.59,90.55 399.82,93.78 412.18,93.78 v412.36,93.6
  Bottom 0.254: D8.C 63.55,104.19 v64.68,104.19
COL_18  (via drill 0.3)  (1 unrouted)
  Top 0.203: U1.30 408.57,109.75 409.3,109.75 409.31,109.76 v411.96,109.76 | v410.3,106.69 409.84,106.22 409.84,104 410.09,103.75 410.09,102.36 411.23,101.22 411.23,96.91 411.23,96.9 411.23,96.36 411.57,96.02 v411.57,93.17 | 368.84,93.59 382.14,93.59 382.31,93.43 384.88,93.43 386.96,91.36 v386.96,89.94
  Top 0.254: v46.89,104.19 57.49,93.59 368.84,93.59
  Bottom 0.203: D7.C 30.27,104.33 19.59,93.65 19.59,82.11 D9.C 26.57,64.96 D11.C 35.46,42.1 D13.C 40.55,26.86 D15.C 49.44,11.62 D17.C | v411.96,109.76 410.75,108.54 410.75,107.23 410.3,106.79 v410.3,106.69 | v386.96,89.94 387.31,89.94 387.53,89.72 388.03,89.72 388.28,89.97 390.21,89.97 390.43,90.19 396.4,90.19 396.75,89.84 400.34,89.84 401.77,89.84 405.1,93.17 v411.57,93.17
  Bottom 0.254: D7.C 45.77,104.19 v46.89,104.19
COL_19  (via drill 0.3)  (1 unrouted)
  Top 0.203: U1.31 411.14,110.15 v411.36,110.37 | v409.25,106.5 409.48,106.27 409.48,103.81 409.73,103.55 409.73,102.21 409.73,102.16 410.87,101.02 410.87,96.22 410.96,96.12 v410.96,92.57 | 368.84,93.14 382.1,93.14 382.16,93.08 382.96,93.08 v386.1,89.94
  Top 0.254: v9.81,104.06 20.73,93.14 368.84,93.14
  Bottom 0.203: D1.C 2.32,99.12 2.32,77.14 4.33,75.12 D2.C 7.52,59.88 D3.C 11.33,51.36 9.68,49.7 9.68,41.21 D4.C 13.88,23.05 D5.C 18.95,5.27 D6.C | v411.36,110.37 411.36,109.66 410.39,108.69 410.39,107.64 409.61,106.85 v409.25,106.5 | v386.1,89.94 | v386.1,89.94 386.7,89.33 390.68,89.33 391.19,89.84 396.25,89.84 396.61,89.48 401.91,89.48 405.25,92.82 410.71,92.82 v410.96,92.57
  Bottom 0.254: D1.C 7.8,104.06 v9.81,104.06
D_N
  Top 0.203: J1.D- 419.53,118.1 419.34,117.9 419.34,116.26 R2.1
D_P
  Top 0.203: J1.D+ 418.88,117.95 418.93,117.9 418.93,116.26 R3.1
GND  (via drill 0.3)  (1 unrouted)
  other vias: 407.83,106.35 412.53,110.41 408.34,115.24 405.8,107.62 398.43,104.06 397.03,101.27 401.23,100.89 400.34,100.89 392.08,101.14 386.75,105.2 395,120.95 412.02,119.3 424.85,118.54 414.56,112.95 414.56,111.17 416.97,112.95 421.67,112.82 424.47,110.92 427.39,109.52 426.12,115.62 416.72,101.39 424.47,98.34 409.61,97.58 414.18,97.58 388.02,101.01 389.92,95.3 367.19,109.39 368.08,111.68 366.55,111.68 359.06,110.28 359.06,111.55
  pour Top (rank 3): 375.83,123.75 375.83,94.53 428.4,94.53 428.4,123.75
  pour Bottom (rank 3): 375.7,94.53 375.7,123.75 428.4,123.75 428.4,94.53
  pour Top: 348.9,121.97 348.9,106.73 373.54,106.73 373.54,121.97
  pour Bottom: 348.9,122.09 348.9,106.85 373.54,106.85 373.54,122.09
N$1
  Top 0.305: U1.1 398.86,112.65 397.87,113.64 Y1.1
N$2
  Top 0.305: U1.43 404.02,116.54 C2.1
N$3
  Top 0.305: U1.2 398.9,112.15 397.99,111.24 Y1.3
N$4
  Top 0.203: U1.6 399.98,110.06 398.72,110.06 397.04,108.38 C3.1
  Top 0.305: C3.1 L1.1
N$6
  Top 0.203: U2.4 418.94,105.9 418.75,106.09 418.75,108.38 419,108.63 419.89,108.63 420.09,108.83 Q2.1 419.53,109.54 419.26,109.27 417.1,109.27 416.76,109.61 R4.1
N$8
  Top 0.406: J1.VBUS 420.18,117.75 421.03,116.89 F1-1.1
N$9
  Top 0.508: PWRON.A R7.1
N$10
  Top 0.406: R11.1 .SCRL.A
N$11
  Top 0.508: R9.1 .NUM.A
N$12  (via drill 0.3)
  Top 0.356: .NUM.C 384.46,121.18 v384.46,120.57
  Top 0.508: 383.16,122.47 .NUM.C | Q3.3 v389.16,116.76
  Bottom 0.356: v384.46,120.57 388.27,116.76 v389.16,116.76
N$15  (via drill 0.3)
  Top 0.203: Q1.3 382.43,110.28 v380.78,111.93
  Top 0.356: v381.92,120.7 381.92,121.18 .SCRL.C
  Bottom 0.356: v380.78,111.93 381.92,113.08 v381.92,120.7
N$20
  Top 0.203: U4.1 359.53,116.93 358.6,117.86 Y2.1
N$21
  Top 0.203: Y2.3 358.65,115.46 359.62,116.43 U4.2
N$22
  Top 0.203: U4.8 359.47,113.43 359.06,113.84 357.17,113.84 C9.1 L2.1
N$23
  Top 0.203: U4.55 367.81,120.27 C13.1
N$24
  Top 0.406: R13.1 .CAPS.A
N$25
  Top 0.406: Q4.3 377.73,112.95 376.84,113.84 376.84,121.97 377.32,122.45 .CAPS.C
N$33
  Bottom 0.762: ESC.2 7.52,108.63 D1.A
N$34
  Bottom 0.203: ESC.A 45.02,119.3 45.95,118.37 47.87,118.37 F1.A 63.94,119.43 65,118.37 65.88,118.37 66.93,119.43 F2.A 82.99,119.43 84.05,118.37 84.93,118.37 85.98,119.43 F3.A 102.04,119.43 103.1,118.37 103.98,118.37 105.03,119.43 F4.A 130.62,119.43 131.67,118.37 132.55,118.37 133.61,119.43 F5.A 149.67,119.43 150.72,118.37 151.6,118.37 152.66,119.43 F6.A 168.84,119.43 169.77,120.36 171.69,120.36 F7.A 187.89,119.3 188.82,118.37 190.74,118.37 F8.A 216.34,119.43 217.4,118.37 218.28,118.37 219.33,119.43 F9.A 235.39,119.43 236.45,118.37 237.33,118.37 238.38,119.43 F10.A 254.44,119.43 255.5,118.37 256.38,118.37 257.43,119.43 F11.A 273.62,119.43 274.55,120.36 276.47,120.36 F12.A 297.24,119.3 298.3,118.24 299.17,118.24 300.23,119.3 PRTSC.A 316.29,119.3 317.35,118.24 318.23,118.24 319.28,119.3 SCRLK.A 335.34,119.3 336.4,118.24 337.27,118.24 338.33,119.3 PAUSE.A
N$35
  Bottom 0.762: F1.2 45.62,108.76 D7.A
N$36
  Bottom 0.762: D2.A 7.52,80.18 `~.2
N$37
  Bottom 0.203: D3.A 11.33,61.26 TAB.2
N$38
  Bottom 0.203: D4.A 13.88,42.34 CAPS.2
N$39
  Bottom 0.203: D5.A 18.95,23.42 L_SHFT.2
N$40
  Bottom 0.203: D6.A 10.06,3.73 L_CTRL.2
N$42
  Bottom 0.762: F2.2 63.4,108.51 D8.A
N$43
  Bottom 0.762: 1.2 26.57,80.18 D9.A
N$44
  Bottom 0.762: 2.2 44.36,79.93 D10.A
N$45
  Bottom 0.203: D11.A 35.59,58.2 Q.2
N$46
  Bottom 0.203: D12.A 54.51,61.52 W.2
N$47
  Bottom 0.203: D13.A 40.55,42.34 A.2
N$48
  Bottom 0.203: D14.A 59.59,42.34 S.2
N$49
  Bottom 0.203: D15.A 49.44,23.16 Z.2
N$50
  Bottom 0.203: D16.A 68.99,23.29 X.2
N$51
  Bottom 0.203: D17.A 38.78,4.49 OS.2
N$52
  Bottom 0.203: D18.A 57.69,3.73 L_ALT.2
N$53
  Bottom 0.203: D19.A 87.53,23.16 C.2
N$54
  Bottom 0.203: D20.A 78.64,42.34 D.2
N$55
  Bottom 0.203: D21.A 73.56,61.52 E.2
N$56
  Bottom 0.762: 3.2 64.68,80.18 D22.A
N$57
  Bottom 0.762: F3.2 82.45,108.51 D23.A
N$58
  Bottom 0.762: F4.2 102.77,108.76 D24.A
N$59
  Bottom 0.762: 4.2 83.73,80.18 D25.A
N$60
  Bottom 0.203: D26.A 92.62,61.52 R.2
N$61
  Bottom 0.203: D27.A 97.69,42.34 F.2
N$62
  Bottom 0.203: D28.A 106.58,23.16 V.2
N$63
  Bottom 0.203: D29.A 134.03,4.49 SPACE.2
N$64
  Bottom 0.203: D30.A 126.9,22.65 B.2
N$65
  Bottom 0.203: D31.A 115.48,41.58 G.2
N$66
  Bottom 0.203: D32.A 111.67,61.52 T.2
N$67
  Bottom 0.203: D33.A 101.5,79.93 5.2
N$68
  Bottom 0.762: F5.2 130.71,109.14 D34.A
N$69
  Bottom 0.762: F6.2 149.76,109.14 D35.A
N$70
  Bottom 0.203: D36.A 121.82,80.18 6.2
N$71
  Bottom 0.203: D37.A 130.71,61.52 Y.2
N$72
  Bottom 0.203: D38.A 135.8,42.34 H.2
N$73
  Bottom 0.203: D39.A 145.95,22.65 N.2
N$74
  Bottom 0.203: D40.A 163.74,23.16 M.2
N$75
  Bottom 0.203: D41.A 154.84,42.34 J.2
N$76
  Bottom 0.203: D42.A 149.76,61.52 U.2
N$77
  Bottom 0.203: 7.2 140.37,77.63 D43.A
N$78
  Bottom 0.762: F7.2 168.81,109.01 D44.A
N$79
  Bottom 0.762: F8.2 187.87,109.14 D45.A
N$80
  Bottom 0.203: 8.2 159.42,77.88 D46.A
N$81
  Bottom 0.203: D47.A 168.81,61.52 I.2
N$82
  Bottom 0.203: D48.A 173.89,42.34 K.2
N$83
  Bottom 0.203: D49.A 182.78,23.16 ,.2
N$84
  Bottom 0.762: F9.2 215.81,108.51 D50.A
N$85
  Bottom 0.203: 9.2 177.7,79.93 D51.A
N$86
  Bottom 0.203: D52.A 187.87,61.52 O.2
N$87
  Bottom 0.203: D53.A 192.94,42.34 L.2
N$88
  Bottom 0.203: ..2 202.22,20.35 D54.A
N$89
  Bottom 0.203: D55.A 205.15,4.49 R_ALT.2
N$90
  Bottom 0.203: D56.A 229.28,4.49 FN.2
N$91
  Bottom 0.203: ?.2 221.27,20.86 D57.A
N$92
  Bottom 0.203: D58.A 212,42.34 COL.2
N$93
  Bottom 0.203: D59.A 206.92,61.52 P.2
N$94
  Bottom 0.203: 0.2 198.02,80.18 D60.A
N$95
  Bottom 0.762: F10.2 236.12,108.76 D61.A
N$96
  Bottom 0.762: F11.2 255.17,108.76 D62.A
N$97
  Bottom 0.203: -.2 215.81,79.93 D63.A
N$98
  Bottom 0.203: D64.A 225.97,61.52 [.2
N$99
  Bottom 0.203: D65.A 231.04,42.34 '".2
N$100
  Bottom 0.203: D66.A 256.45,23.03 R_SHFT.2
N$101
  Bottom 0.203: D67.A 252.14,4.49 MENU.2
N$102
  Bottom 0.203: D68.A 276.27,4.49 R_CTRL.2
N$103
  Bottom 0.203: D69.A 261.52,42.34 ENT.2
N$104
  Bottom 0.203: D70.A 245.01,61.52 ].2
N$105
  Bottom 0.203: =.2 236.12,80.18 D71.A
N$106
  Bottom 0.762: F12.2 274.23,108.63 D72.A
N$107
  Bottom 0.762: PRTSC.2 297.09,108.76 D73.A
N$108
  Bottom 0.203: BCKSPC.2 264.06,80.57 D74.A
N$109
  Bottom 0.203: D75.A 269.14,61.39 \|\.2
N$110
  Bottom 0.203: D76.A 297.09,61.13 DEL.2
N$111
  Bottom 0.203: INS.2 297.09,80.31 D77.A
N$112
  Bottom 0.762: SCRLK.2 316.13,108.76 D78.A
N$113
  Bottom 0.762: PAUSE.2 335.18,108.76 D79.A
N$114
  Bottom 0.203: HOME.2 316.13,80.31 D80.A
N$115
  Bottom 0.203: D81.A 316.13,61.13 END.2
N$116
  Bottom 0.203: D82.A 316.13,23.16 UP.2
N$117
  Bottom 0.203: D83.A 302.94,4.49 LFT.2
N$118
  Bottom 0.203: D84.A 321.99,4.49 DWN.2
N$119
  Bottom 0.203: D85.A 341.04,4.49 RGHT.2
N$120
  Bottom 0.203: D86.A 374.06,4.49 0.0.2
N$121
  Bottom 0.203: 11.2 359.31,23.42 D87.A
N$122
  Bottom 0.203: 44.2 359.31,42.47 D88.A
N$123
  Bottom 0.203: D89.A 359.31,61.52 77.2
N$124
  Bottom 0.203: D90.A 335.18,61.26 PGDN.2
N$125
  Bottom 0.203: PGUP.2 335.18,80.31 D91.A
N$126
  Bottom 0.203: NUM.2 359.31,80.57 D92.A
N$127
  Bottom 0.203: /.2 378.37,80.57 D93.A
N$128
  Bottom 0.203: D94.A 378.49,58.2 88.2
N$129
  Bottom 0.203: 55.2 378.37,42.47 D95.A
N$130
  Bottom 0.203: 22.2 378.37,23.42 D96.A
N$131
  Bottom 0.203: D97.A 403.27,4.49 .DEL.2
N$132
  Bottom 0.203: 33.2 397.41,23.42 D98.A
N$133
  Bottom 0.203: 66.2 397.41,42.47 D99.A
N$134
  Bottom 0.203: 99.2 397.41,61.39 D100.A
N$135
  Bottom 0.203: *.2 397.41,80.57 D101.A
N$136
  Bottom 0.203: --.2 416.47,80.57 D102.A
N$137
  Bottom 0.203: ENTER.2 416.47,13.89 D104.A
N$158
  Bottom 0.203: D103.A 416.59,49.31 +.2
NUM  (via drill 0.3)  (1 unrouted)
  Top 0.203: v397.16,115.24 392,120.4 Q3.1 390.01,120.5 | v412.15,103.17 412.15,106.6 411.1,107.65
  Top 0.508: 390.01,120.5 R10.2
  Bottom 0.203: v397.16,115.24 397.03,115.24 395.64,113.84 395.64,104.91 397.62,102.92 401.61,102.92 401.99,103.3 402.5,103.3 402.88,102.92 411.89,102.92 v412.15,103.17
ROW_0  (via drill 0.3)  (1 unrouted)
  Top 0.203: ESC.1 13.49,111.81 F1.1 F2.1 F3.1 89.69,111.68 109.12,111.68 109,111.81 F4.1 F5.1 F6.1 156.37,111.68 F7.1 175.42,111.81 F8.1 F9.1 F10.1 F11.1 261.14,111.68 F12.1 PRTSC.1 SCRLK.1 PAUSE.1 | U1.32 406.67,110.65 v406.43,110.41 | v408.87,105.66 409.12,105.41 409.12,103.66 409.38,103.41 409.38,102.01 410.51,100.87 410.51,92.97 410.36,92.82 410.36,92.32 410.37,92.3 v410.37,88.82
  Top 0.406: ENTER.1 422.56,16.94 422.56,54.15 +.1 422.56,54.91 422.56,82.85 --.1
  Bottom 0.203: PAUSE.1 357.28,96.31 357.28,90.22 358.68,88.82 v410.37,88.82 420.78,88.82 422.31,87.3 422.31,83.87 --.1 | v406.43,110.41 408.64,108.2 408.64,105.89 v408.87,105.66 408.87,105.81
ROW_1  (via drill 0.3)  (1 unrouted)
  Top 0.203: *.1 v390.81,83.23 /.1 NUM.1 365.66,83.11 341.28,83.11 | 341.28,83.11 341.41,83.23 PGUP.1 | 341.28,83.11 341.15,83.23 HOME.1 INS.1 BCKSPC.1 =.1 241.84,83.11 222.15,83.11 | 222.15,83.11 222.28,83.23 -.1 | 222.15,83.11 222.03,83.23 0.1 203.74,83.11 184.31,83.11 | 184.31,83.11 184.44,83.23 9.1 | 184.31,83.11 184.18,83.23 8.1 7.1 6.1 5.1 4.1 3.1 2.1 1.1 `~.1 | U1.8 398.82,109.15 397.9,108.23 397.9,107.84 393.96,103.91 393.96,94.76 392.84,93.65 392.84,89.71 390.89,87.76 v390.89,86.71
  Bottom 0.203: v390.89,86.71 390.81,86.63 v390.81,83.23
ROW_2  (via drill 0.3)  (1 unrouted)
  Top 0.203: 99.1 384.97,64.06 88.1 377.48,64.18 | 377.48,64.18 77.1 PGDN.1 322.99,64.18 END.1 DEL.1 | DEL.1 303.43,64.06 303.31,63.93 | 303.31,63.93 303.69,63.93 DEL.1 | 303.31,63.93 275.5,63.93 \|\.1 ].1 [.1 P.1 O.1 I.1 U.1 Y.1 T.1 R.1 E.1 W.1 Q.1 TAB.1 | U1.7 398.82,109.65 397.54,108.38 397.54,108 393.61,104.06 393.61,94.91 392.49,93.79 392.49,89.86 390.28,87.65 390.28,86.63 v390.03,86.38 | v389.03,76.88 379.76,76.88 377.48,74.6 377.48,64.18
  Bottom 0.203: v390.03,86.38 390.03,77.88 v389.03,76.88
ROW_3  (via drill 0.3)  (1 unrouted)
  Top 0.203: 66.1 55.1 44.1 ENT.1 '".1 COL.1 L.1 K.1 J.1 H.1 G.1 F.1 D.1 S.1 A.1 CAPS.1 | U1.47 402.02,115.07 401.73,115.36 401.23,115.36 400.59,114.73 400.59,114.22 399.83,113.46 398.94,113.46 397.92,114.47 396.78,114.47 396.27,114.98 394.37,114.98 v393.86,114.47 | v392.34,107.49 393.25,106.58 393.25,95.06 392.13,93.94 392.13,90 389.93,87.8 389.93,87.49 v389.68,87.24 | v389.43,80.44 389.43,77.35 389.64,77.13 389.64,76.63 388.4,75.39 v388.4,74.09
  Bottom 0.203: v393.86,114.47 392.34,112.95 v392.34,107.49 | v389.68,87.24 389.68,86.88 389.43,86.63 389.43,86.13 389.68,85.88 389.68,80.69 v389.43,80.44 | 55.1 387,45.13 388.14,46.28 388.14,72.69 388.4,72.95 v388.4,74.09
ROW_4  (via drill 0.3)  (1 unrouted)
  Top 0.203: L_SHFT.1 Z.1 75.09,26.08 X.1 94.14,25.96 C.1 V.1 B.1 N.1 M.1 ,.1 ..1 ?.1 R_SHFT.1 UP.1 323.25,25.7 323.63,26.08 11.1 22.1 33.1 | U1.19 404.52,102.67 v405.54,101.65 405.54,101.36 404.55,100.37 404.55,90.83 411.92,83.47 411.92,29.79 411.03,28.9
  Top 0.406: 411.03,28.9 408.21,26.08 33.1
ROW_5  (via drill 0.3)  (1 unrouted)
  Top 0.203: .DEL.1 0.0.1 RGHT.1 DWN.1 322.74,6.91 302.8,6.91 302.93,7.03 LFT.1 R_CTRL.1 MENU.1 FN.1 R_ALT.1 SPACE.1 L_ALT.1 63.02,6.78 39.02,6.78 39.27,7.03 OS.1 L_CTRL.1 | U1.20 405.02,103.18 406.3,101.9 406.3,101.27 v405.54,100.5 404.91,99.87 404.91,90.98 412.27,83.61 412.27,13 411.64,12.37
  Top 0.406: .DEL.1 404.02,6.91 406.18,6.91 411.64,12.37
RST  (via drill 0.3)
  Top 0.254: U1.40 405.52,117.5 406.56,118.54 v407.7,118.54 408.34,119.17 408.34,122.09 407.7,122.73 RESET.3 RESET.4
  Top 0.508: R1.1 400.65,122.69 RESET.4
  Bottom 0.254: J2.10 422.94,98.73 425.14,100.92 426.22,100.92 427.1,101.79 427.1,103.02 426.22,103.9 424.99,103.9 424.85,103.76 414.87,103.76 414.31,104.31 414.31,104.7 413.67,105.34 413.67,113.27 410.15,116.78 408.21,116.78 407.7,117.29 v407.7,118.54
RST1  (via drill 0.3)
  Top 0.203: RESET1.4 v352.08,118.03 RESET1.3 R8.1 | U4.52 369.31,116.47 v368.97,116.13
  Bottom 0.203: v368.97,116.13 353.98,116.13 v352.08,118.03
SCRL  (via drill 0.3)
  Top 0.203: v390.15,111.65 390.15,106.42 385.1,101.37 382.07,101.37 381.45,101.99 R12.2 | v407.09,117.01 407.02,116.95 U1.37
  Top 0.508: R12.2 381.48,102.69 Q1.1
  Bottom 0.203: v390.15,111.65 390.15,114.83 393.33,118.01 406.33,118.01 407.09,117.25 v407.09,117.01
SWCLK  (via drill 0.3)  (1 unrouted)
  Top 0.254: U1.45 403.02,112.9 v403.48,112.44
  Bottom 0.254: v403.48,112.44 403.48,112.28 403.03,111.83 403.03,105.5 404.82,103.7 411.21,103.7 411.72,104.21 412.63,104.21 413.49,103.35 425.02,103.35 425.16,103.49 426.06,103.49 426.69,102.86 426.69,101.96 426.06,101.33 425.16,101.33 425.02,101.47 419.27,101.47 418.28,100.47 418.28,97.93 J2.4
SWDIO  (via drill 0.3)  (1 unrouted)
  Top 0.254: U1.46 402.52,112.41 v402.62,112.32
  Bottom 0.254: v402.62,112.32 402.62,105.33 404.65,103.3 411.38,103.3 411.88,103.8 412.41,103.8 412.78,103.43 412.78,103.05 412.88,102.94 425.19,102.94 425.33,103.08 425.89,103.08 426.28,102.69 426.28,102.13 425.89,101.74 425.33,101.74 425.19,101.88 419.11,101.88 417.86,100.63 J2.2
USB_D_N  (1 unrouted)
  Top 0.203: R2.2 420.02,113.76 419.34,113.08 419.34,112.48 418.71,111.86 412.74,111.86 412.1,111.22 409.86,111.22 409.79,111.15 U1.33
USB_D_P  (1 unrouted)
  Top 0.203: R3.2 418.24,113.76 418.93,113.08 418.93,112.65 418.54,112.26 412.57,112.26 411.94,111.63 411.64,111.63 arc-90 411.44,111.83 411.44,111.95 arc90 411.23,112.15 410.27,112.15 arc90 410.07,111.95 410.07,111.83 arc-90 409.86,111.63 408.5,111.63 U1.34
USB_HOST_EN  (via drill 0.3)
  Top 0.203: R6.1 v413.29,104.82 | v405.67,111.17 405.02,111.82 U1.41
  Bottom 0.203: v413.29,104.82 413.29,111.3 411.64,112.95 407.45,112.95 v405.67,111.17
USB_ID  (via drill 0.3)
  Top 0.203: J1.ID 418.23,117.38 417.86,117.01 416.21,117.01 v415.32,116.13 | v415.32,109.27 R5.1 | R6.2 R5.1 | R5.1 415.42,107.8 416.34,107.8 | 416.34,107.8 U2.1 | U2.2 416.47,106.85 416.34,106.98 416.34,107.8
  Bottom 0.203: v415.32,116.13 v415.32,109.27
VCC3V3  (via drill 0.3, 0.38)  (2 unrouted)
  Top 0.203: R1.2 v398.43,116.25 | R8.2 352.14,112.32 353.47,112.32 353.75,112.04 L2.2 355.39,112.04 C12.1 C11.1 364.78,108.81 | C10.1 367.31,121.42 U4.56 367.31,111.35 | 364.78,108.81 364.85,108.81 365.31,108.35 U4.21 | 367.31,111.35 364.78,108.81 | U4.34 368.73,109.93 367.31,111.35
  Top 0.305: U1.44 403.52,115.1 403.13,115.49 402.37,115.49 402.24,115.62 C1.1 | U1.17 C5.1 | U1.36 409.82,112.65 410.28,113.12 C4.1
  Top 0.508: U3.5 425.92,104.92 C8.1 425.7,102.5 v425.61,102.41 | v410.24,115.74 410.24,114.13 C4.1 | C1.1 401.14,116.67 v400.72,116.25 | L1.2 v393.1,109.78 387.6,115.28 R7.2 R9.2 R11.2 R13.2 | C5.1 402.84,103.13 v402.11,102.41
  Bottom 0.254: J2.1 417.74,95.81 416.97,96.57 416.97,97.96 417.46,98.45 417.46,100.8 418.94,102.28 419.77,102.28 419.89,102.41
  Bottom 0.508: v425.61,102.41 419.89,102.41 v402.11,102.41 397.41,102.41 395.13,104.7 395.13,109.9 | 395.13,109.9 395.13,114.6 396.78,116.25 v398.43,116.25 v400.72,116.25 409.73,116.25 v410.24,115.74 | v393.1,109.78 395,109.78 395.13,109.9
VIN  (via drill 0.38)
  Top 0.203: R4.2 419.13,110.28 419.51,110.66 420.53,110.66 421.04,110.16 421.04,108.89 420.4,108.25 420.4,107.7
  Top 0.508: 424.02,109.58 U3.3 | 424.02,109.58 423.83,109.78 423.07,109.78 422.83,109.54 Q2.2 421.99,107.89 C7.1 420.53,107.83 | 424.02,109.58 424.47,110.03 425.74,110.03 425.92,109.84 U3.1 425.92,107.94 426.37,107.49 427.13,107.49 427.51,107.11 427.51,97.2 VIN.TP | 420.53,107.83 419.95,107.83 U2.5 | R5.2 v415.32,104.7 | v420.4,106.85 420.4,107.7 420.53,107.83
  Bottom 0.508: v415.32,104.7 420.27,104.7 420.78,105.2 420.78,106.47 v420.4,106.85
VUSB
  Top 0.813: C6.1 423.32,111.64 Q2.3
  Top 1.016: F1-1.2 423.74,114.05 C6.1

## Text on the board
tPlace: C:/Users/GlaDOS/Desktop/44becd67f1f47b6ca31f48a6107be438_converted.bmp